# EAGLE design Power Supply 2_Andrew_editted (EAGLE 9.2.2)
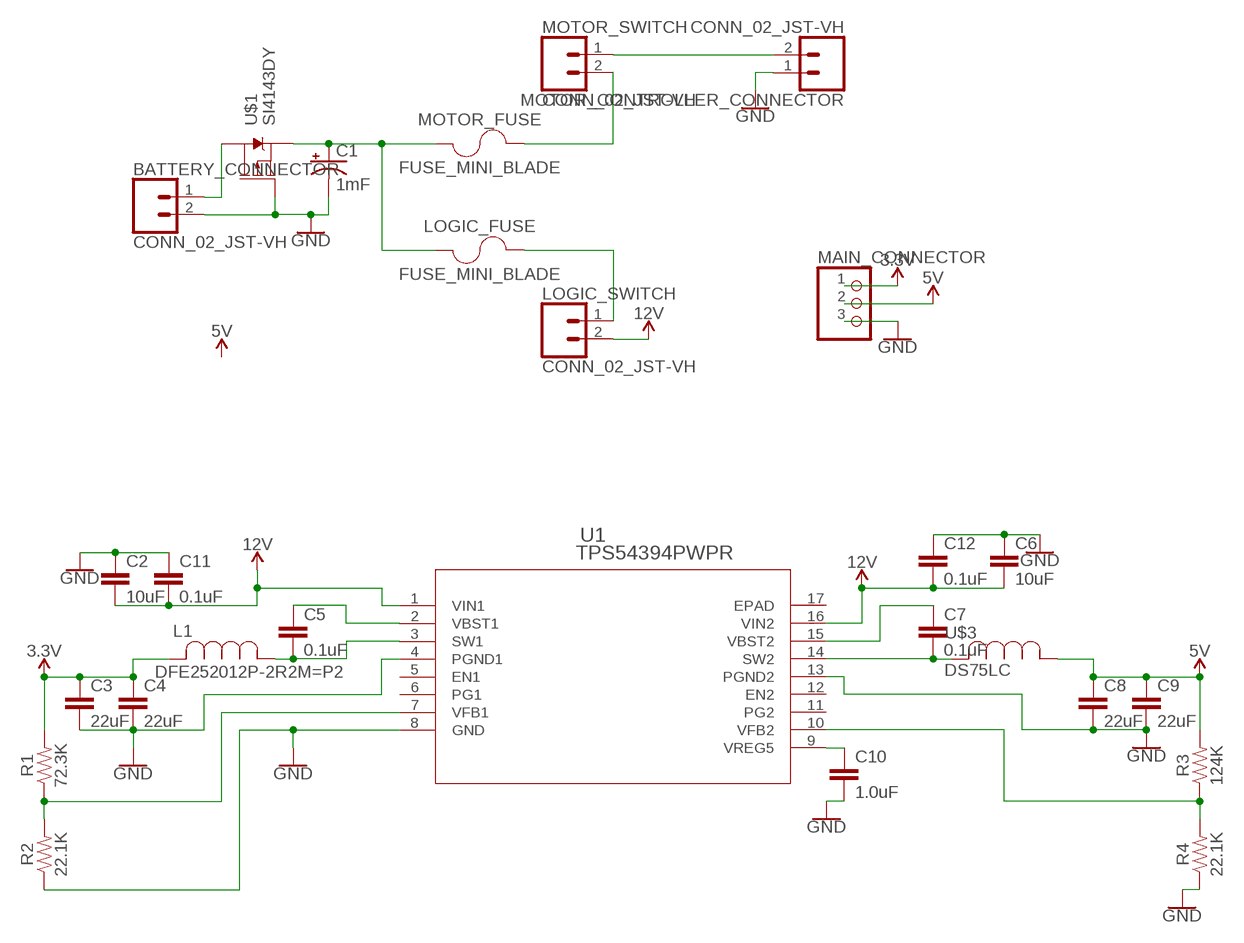
[diagram p0: schematic, sheet 1]

## Parts
BATTERY_CONNECTOR  CONN_02_JST-VH  [B2P-VH]
C1  1mF  1000UF-RADIAL-5MM-25V-20%  [CPOL-RADIAL-5MM-10MM]
C2  10uF  10UF-0805-10V-10%  [0805]
C3  22uF  22UF-0805-6.3V-20%  [0805]
C4  22uF  22UF-0805-6.3V-20%  [0805]
C5  0.1uF  0.1UF-0603-25V-5%  [0603]
C6  10uF  10UF-0805-10V-10%  [0805]
C7  0.1uF  0.1UF-0603-25V-5%  [0603]
C8  22uF  22UF-0805-6.3V-20%  [0805]
C9  22uF  22UF-0805-6.3V-20%  [0805]
C10  1.0uF  1.0UF-0805-25V-10%  [0805]
C11  0.1uF  0.1UF-0603-25V-5%  [0603]
C12  0.1uF  0.1UF-0603-25V-5%  [0603]
L1  DFE252012P-2R2M=P2  [DFE252012P-1R0M=P2]
LOGIC_FUSE  FUSE_MINI_BLADE  [SL-1538]
LOGIC_SWITCH  CONN_02_JST-VH  [B2P-VH]
MAIN_CONNECTOR  PINHD-1X3  [1X03]
MOTOR_CONTROLLER_CONNECTOR  CONN_02_JST-VH  [B2P-VH]
MOTOR_FUSE  FUSE_MINI_BLADE  [SL-1538]
MOTOR_SWITCH  CONN_02_JST-VH  [B2P-VH]
R1  72.3K  75KOHM-0603-1/10W-1%  [0603]
R2  22.1K  75KOHM-0603-1/10W-1%  [0603]
R3  124K  75KOHM-0603-1/10W-1%  [0603]
R4  22.1K  75KOHM-0603-1/10W-1%  [0603]
U1  TPS54394PWPR  [PWP16_3P4X2P46]
U$1  SI4143DY  [SO-8]
U$3  DS75LC  [DS75LC]

## Nets
3.3V: C3.1 C4.1 L1.2 MAIN_CONNECTOR.1 R1.2
5V: C8.1 C9.1 MAIN_CONNECTOR.2 R3.2 U$3.P$1
12V: C2.2 C6.2 C11.2 C12.2 LOGIC_SWITCH.2 U1.1(VIN1) U1.16(VIN2)
GND: BATTERY_CONNECTOR.2 C1.- C2.1 C3.2 C4.2 C6.1 C8.2 C9.2 C10.2 C11.1 C12.1 MAIN_CONNECTOR.3 MOTOR_CONTROLLER_CONNECTOR.1 R2.1 R4.1 U1.4(PGND1) U1.8(GND) U1.13(PGND2) U$1.4(G)
N$1: BATTERY_CONNECTOR.1 U$1.5(D) U$1.6(D) U$1.7(D) U$1.8(D)
N$2: MOTOR_FUSE.P$2 MOTOR_SWITCH.2
N$3: C1.+ LOGIC_FUSE.P$1 MOTOR_FUSE.P$1 U$1.1(S) U$1.2(S) U$1.3(S)
N$4: LOGIC_FUSE.P$2 LOGIC_SWITCH.1
N$5: MOTOR_CONTROLLER_CONNECTOR.2 MOTOR_SWITCH.1
N$6: C5.1 U1.2(VBST1)
N$7: C5.2 L1.1 U1.3(SW1)
N$8: C7.1 U1.15(VBST2)
N$9: R1.1 R2.2 U1.7(VFB1)
N$10: C7.2 U1.14(SW2) U$3.P$2
N$11: C10.1 U1.9(VREG5)
N$14: R3.1 R4.2 U1.10(VFB2)
Unconnected: U1.5(EN1) U1.6(PG1) U1.11(PG2) U1.12(EN2) U1.17(EPAD)

## Library data of the parts
BATTERY_CONNECTOR LOGIC_SWITCH MOTOR_CONTROLLER_CONNECTOR MOTOR_SWITCH = JST-VH:CONN_02_JST-VH: B2P-VH(LF)(SN) Digikey <https://www.digikey.com.au/product-detail/en/jst-sales-america-inc/B2P-VH-LF-SN/455-1639-ND/926547>
C1 = SparkFun-Capacitors:1000UF: 1,000µF/1mF ceramic capacitors A capacitor is a passive two-terminal electrical component used to store electrical energy temporarily in an electric field. CAP-08070; PROD_ID: CAP-09538
C2 C6 = SparkFun-Capacitors:10UF: 10.0µF ceramic capacitors A capacitor is a passive two-terminal electrical component used to store electrical energy temporarily in an electric field.; PROD_ID: CAP-11330
C3 C4 C8 C9 = SparkFun-Capacitors:22UF: 22µF ceramic capacitors A capacitor is a passive two-terminal electrical component used to store electrical energy temporarily in an electric field.; PROD_ID: CAP-08402
C5 C7 C11 C12 = SparkFun-Capacitors:0.1UF: 0.1µF ceramic capacitors A capacitor is a passive two-terminal electrical component used to store electrical energy temporarily in an electric field.; PROD_ID: CAP-08604
C10 = SparkFun-Capacitors:1.0UF: 1µF ceramic capacitors A capacitor is a passive two-terminal electrical component used to store electrical energy temporarily in an electric field.; PROD_ID: CAP-08064
L1 = Inductor:DFE252012P-2R2M=P2; MANUFACTURER_PART_NUMBER: DFE252012P2R2M=P2; VENDOR: Murata
LOGIC_FUSE MOTOR_FUSE = Fuse_Holder:FUSE_MINI_BLADE: SL-1538 Aliexpress <https://www.aliexpress.com/item/SL-1538-MINI-Style-Blade-Fuse-Holers-PCB-Mount-Fuse-holders-0153008/503553051.html>
MAIN_CONNECTOR = PinHead+:PINHD-1X3: PIN HEADER
R1-R4 = SparkFun-Resistors:75KOHM: 75Ω resistor A resistor is a passive two-terminal electrical component that implements electrical resistance as a circuit element. Resistors act to reduce current flow, and, at the same time, act to lower voltage levels within circuits. - Wikipedia; PROD_ID: RES-09737; VALUE: 75
U1 = TPS54394PWP:TPS54394PWPR; MANUFACTURER_PART_NUMBER: TPS54394PWPR; VENDOR: Texas Instruments
U$1 = MOSFET:SI4143DY: MOSFET P-CHANNEL 30V 25.3A 8SO Digikey <https://www.digikey.com.au/product-detail/en/vishay-siliconix/SI4143DY-T1-GE3/SI4143DY-T1-GE3CT-ND/6834487>
U$3 = Inductor:DS75LC

## Board
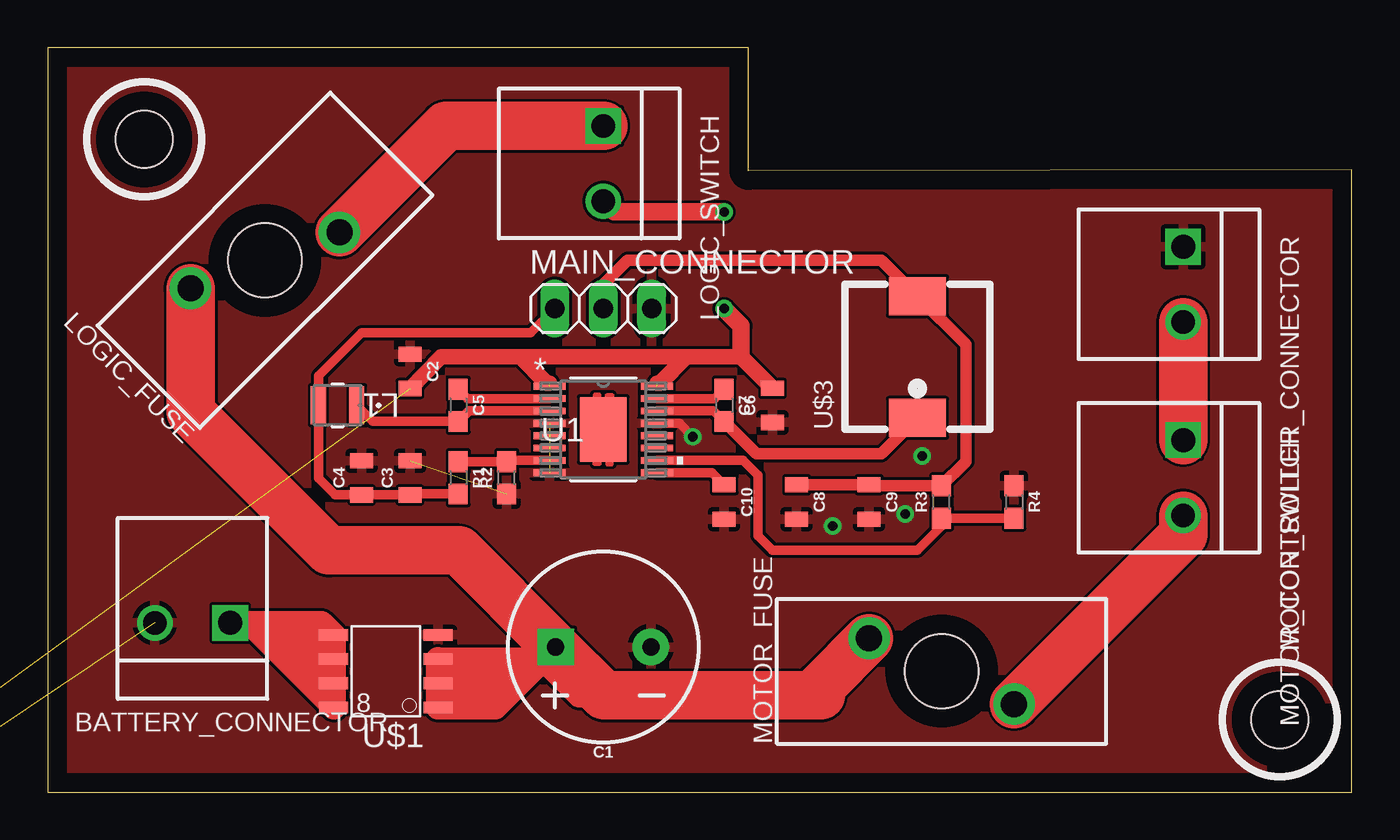
[diagram p1: board, top side]
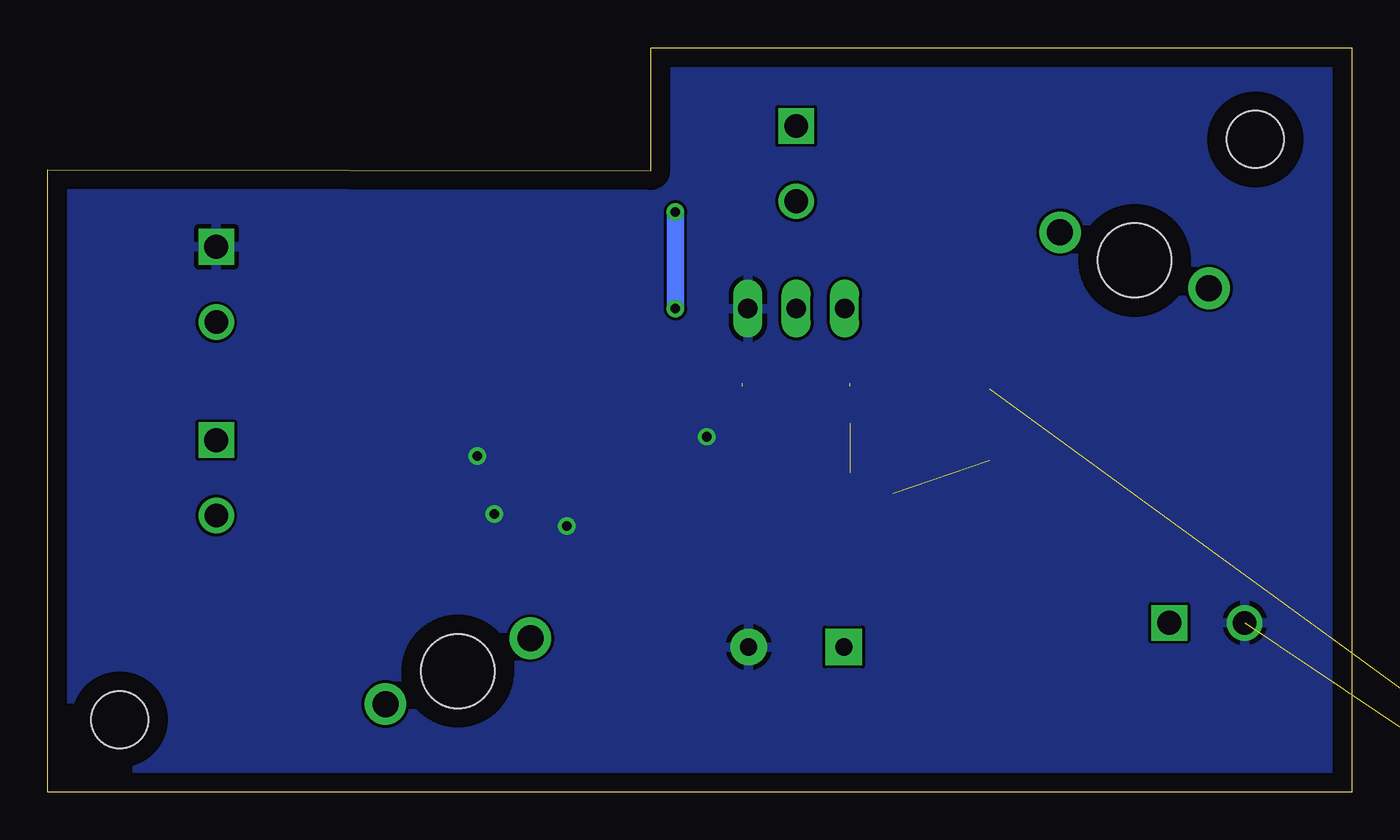
[diagram p2: board, bottom side, seen from below]

Size 68.56 x 39.12 mm. Coordinates in mm from the lower left corner, seen from the top.
Outline: 0,0 68.56,0 68.56,32.69 36.83,32.64 36.83,39.12 0,39.12 0,0
Copper layers (1*16): Top 0.035mm / dielectric 1.5mm / Bottom 0.035mm
Design rules "default": minimum track width 6mil, minimum drill 0.35mm, track to track 6mil, track to pad 6mil, pad to pad 6mil, via to via 6mil, smd to smd 6mil, copper to edge 40mil, drill to drill 6mil, minimum pad ring 10mil, minimum via ring 8mil, stop-mask expansion 4mil, vias tented up to drill 0mil, thermal gap 10mil
Holes 3 mm at 5.08,34.29 64.77,3.81

### Footprints (pad centres in the part's own frame; a part is rotated, then mirrored left to right if it is on the bottom)
B2P-VH = drill 1.25 square: 1 -1.98,0 | drill 1.24: 2 1.98,0
CPOL-RADIAL-5MM-10MM = drill 0.9 pad 1.93 square: + 2.5,0 | drill 0.9 pad 1.93: - -2.5,0
0805 = smd 0.8 x 1.2: 1 -0.9,0; 2 0.9,0
0603 = smd 1.1 x 1: 1 -0.85,0; 2 0.85,0
DFE252012P-1R0M=P2 = smd 0.8 x 2.007: 1 -1,0; 2 1,0
SL-1538 = drill 1.37 pad 2.184: P$1 1.73,3.81; P$2 -1.73,-3.81 | hole 3.88: 0,0
1X03 = drill 1.016 long: 1 -2.54,0; 2 0,0; 3 2.54,0
PWP16_3P4X2P46 = smd 1.676 x 0.356: 1 -2.819,2.275; 2 -2.819,1.625; 3 -2.819,0.975; 4 -2.819,0.325; 5 -2.819,-0.325; 6 -2.819,-0.975; 7 -2.819,-1.625; 8 -2.819,-2.275; 9 2.819,-2.275; 10 2.819,-1.625; 11 2.819,-0.975; 12 2.819,-0.325; 13 2.819,0.325; 14 2.819,0.975; 15 2.819,1.625; 16 2.819,2.275 | smd 2.46 x 3.4: 17 0,0
SO-8 = smd 1.524 x 0.61: 1 -2.743,1.905; 2 -2.743,0.635; 3 -2.743,-0.635; 4 -2.743,-1.905; 5 2.743,-1.905; 6 2.743,-0.635; 7 2.743,0.635; 8 2.743,1.905
DS75LC = smd 2 x 3: P$1 3.2,0; P$2 -3.2,0

### Placement (x,y rotation side)
BATTERY_CONNECTOR  7.62,8.89 180 top
C1  29.21,7.62 180 top
C2  19.05,22.1 270 top
C3  19.05,16.51 90 top
C4  16.51,16.51 90 top
C5  21.59,20.32 270 top
C6  38.1,20.32 90 top
C7  35.56,20.32 270 top
C8  39.37,15.24 270 top
C9  43.18,15.24 270 top
C10  35.56,15.24 270 top
C11  -59.69,-35.56 0 top  (outside the outline)
C12  -59.69,-39.37 0 top  (outside the outline)
L1  15.24,20.32 180 top
LOGIC_FUSE  11.43,27.94 135 top
LOGIC_SWITCH  29.21,33.02 270 top
MAIN_CONNECTOR  29.21,25.4 0 top
MOTOR_CONTROLLER_CONNECTOR  59.69,26.67 270 top
MOTOR_FUSE  46.99,6.35 90 top
MOTOR_SWITCH  59.69,16.51 270 top
R1  21.59,16.51 270 top
R2  24.13,16.51 90 top
R3  46.99,15.24 90 top
R4  50.8,15.24 270 top
U1  29.21,19.05 0 top
U$1  17.78,6.35 180 top
U$3  45.72,22.86 90 top

### Tracks (layer width: path | path; a pad name or v marks a point on that pad's centre or on a via)
3.3V
  Top 0.508: R1.2 19.1,15.66 C3.1 C4.1 15.12,15.61 14.24,16.49 L1.2 14.24,21.86 16.51,24.13 25.4,24.13 MAIN_CONNECTOR.1
5V
  Top 0.61: C8.1 C9.1 43.23,16.09 R3.2 48.26,17.36 48.26,23.52 U$3.P$1 43.84,27.94 30.48,27.94 29.21,26.67 MAIN_CONNECTOR.2
12V  (via drill 0.51)  (4 unrouted)
  Top 0.813: C6.2 36.46,22.86 33.56,22.86 | 33.56,22.86 32.19,21.49 32.03,21.49 | C2.2 20.69,22.86 24.86,22.86 | 24.86,22.86 26.23,21.49 26.39,21.49 | 24.86,22.86 33.56,22.86
  Top 0.914: 36.46,22.86 36.46,24.5 v35.56,25.4 | 35,30.48 v35.56,30.48 29.77,30.48 LOGIC_SWITCH.2
  Bottom 0.914: v35.56,25.4 v35.56,30.48
GND  (via drill 0.51)  (4 unrouted)
  Top 0.508: U1.13 33.2,19.38 v33.91,18.67
  other vias: 41.27,13.97 45.09,14.61 45.97,17.65
  pour Bottom: 149.86,109.22 -17.78,109.22 -62.23,64.77 -62.23,0 -29.21,-33.02 156.21,-33.02 184.15,-5.08 184.15,90.17 170.18,104.14 165.1,109.22
  pour Top: 43.18,114.3 2.54,114.3 -13.97,97.79 -57.15,54.61 -57.15,24.13 -57.15,-15.24 -43.18,-29.21 173.99,-29.21 190.5,-12.7 194.31,-8.89 194.31,102.87 182.88,114.3
N$1
  Top 1.27: BATTERY_CONNECTOR.1 14.4,8.89 U$1.5 U$1.6 | U$1.6 U$1.7 | U$1.7 U$1.8 10.59,8.89 BATTERY_CONNECTOR.1 | BATTERY_CONNECTOR.1 11.86,8.89 U$1.7 | BATTERY_CONNECTOR.1 13.13,8.89 U$1.6
N$2
  Top 2.54: MOTOR_FUSE.P$2 59.69,13.51 MOTOR_SWITCH.2
N$3
  Top 1.27: U$1.2 U$1.1 23.54,4.45 24.8,5.71 | U$1.2 U$1.3 | U$1.3 26.07,6.99 C1.+ | C1.+ 26.71,7.58 29.21,5.08 | MOTOR_FUSE.P$1 43.18,7.62 40.64,5.08 29.21,5.08 | 24.8,5.71 C1.+ | U$1.2 24.8,5.71 | U$1.3 26.04,6.99 27.94,5.08 29.21,5.08
  Top 2.54: MOTOR_FUSE.P$1 40.64,5.54 40.64,5.08 29.25,5.08 C1.+ 21.63,12.7 14.78,12.7 7.51,19.97 LOGIC_FUSE.P$1
N$4
  Top 2.54: LOGIC_FUSE.P$2 20.94,35 LOGIC_SWITCH.1
N$5
  Top 2.54: MOTOR_SWITCH.1 MOTOR_CONTROLLER_CONNECTOR.2
N$6
  Top 0.508: U1.2 22.09,20.68 C5.1
N$7
  Top 0.508: U1.3 22.14,20.02 C5.2 17.09,19.47 L1.1
N$8
  Top 0.508: U1.15 35.06,20.68 C7.1
N$9
  Top 0.508: U1.7 24.2,17.43 R2.2 R1.1
N$10
  Top 0.508: U1.14 35.01,20.02 C7.2
  Top 0.61: C7.2 37.25,17.78 43.84,17.78 U$3.P$2
N$11
  Top 0.508: U1.9 34.92,16.77 C10.1
N$14
  Top 0.508: U1.10 36.55,17.43 37.34,16.64 37.34,13.46 38.1,12.7 45.72,12.7 46.99,13.97 R3.1 R4.2